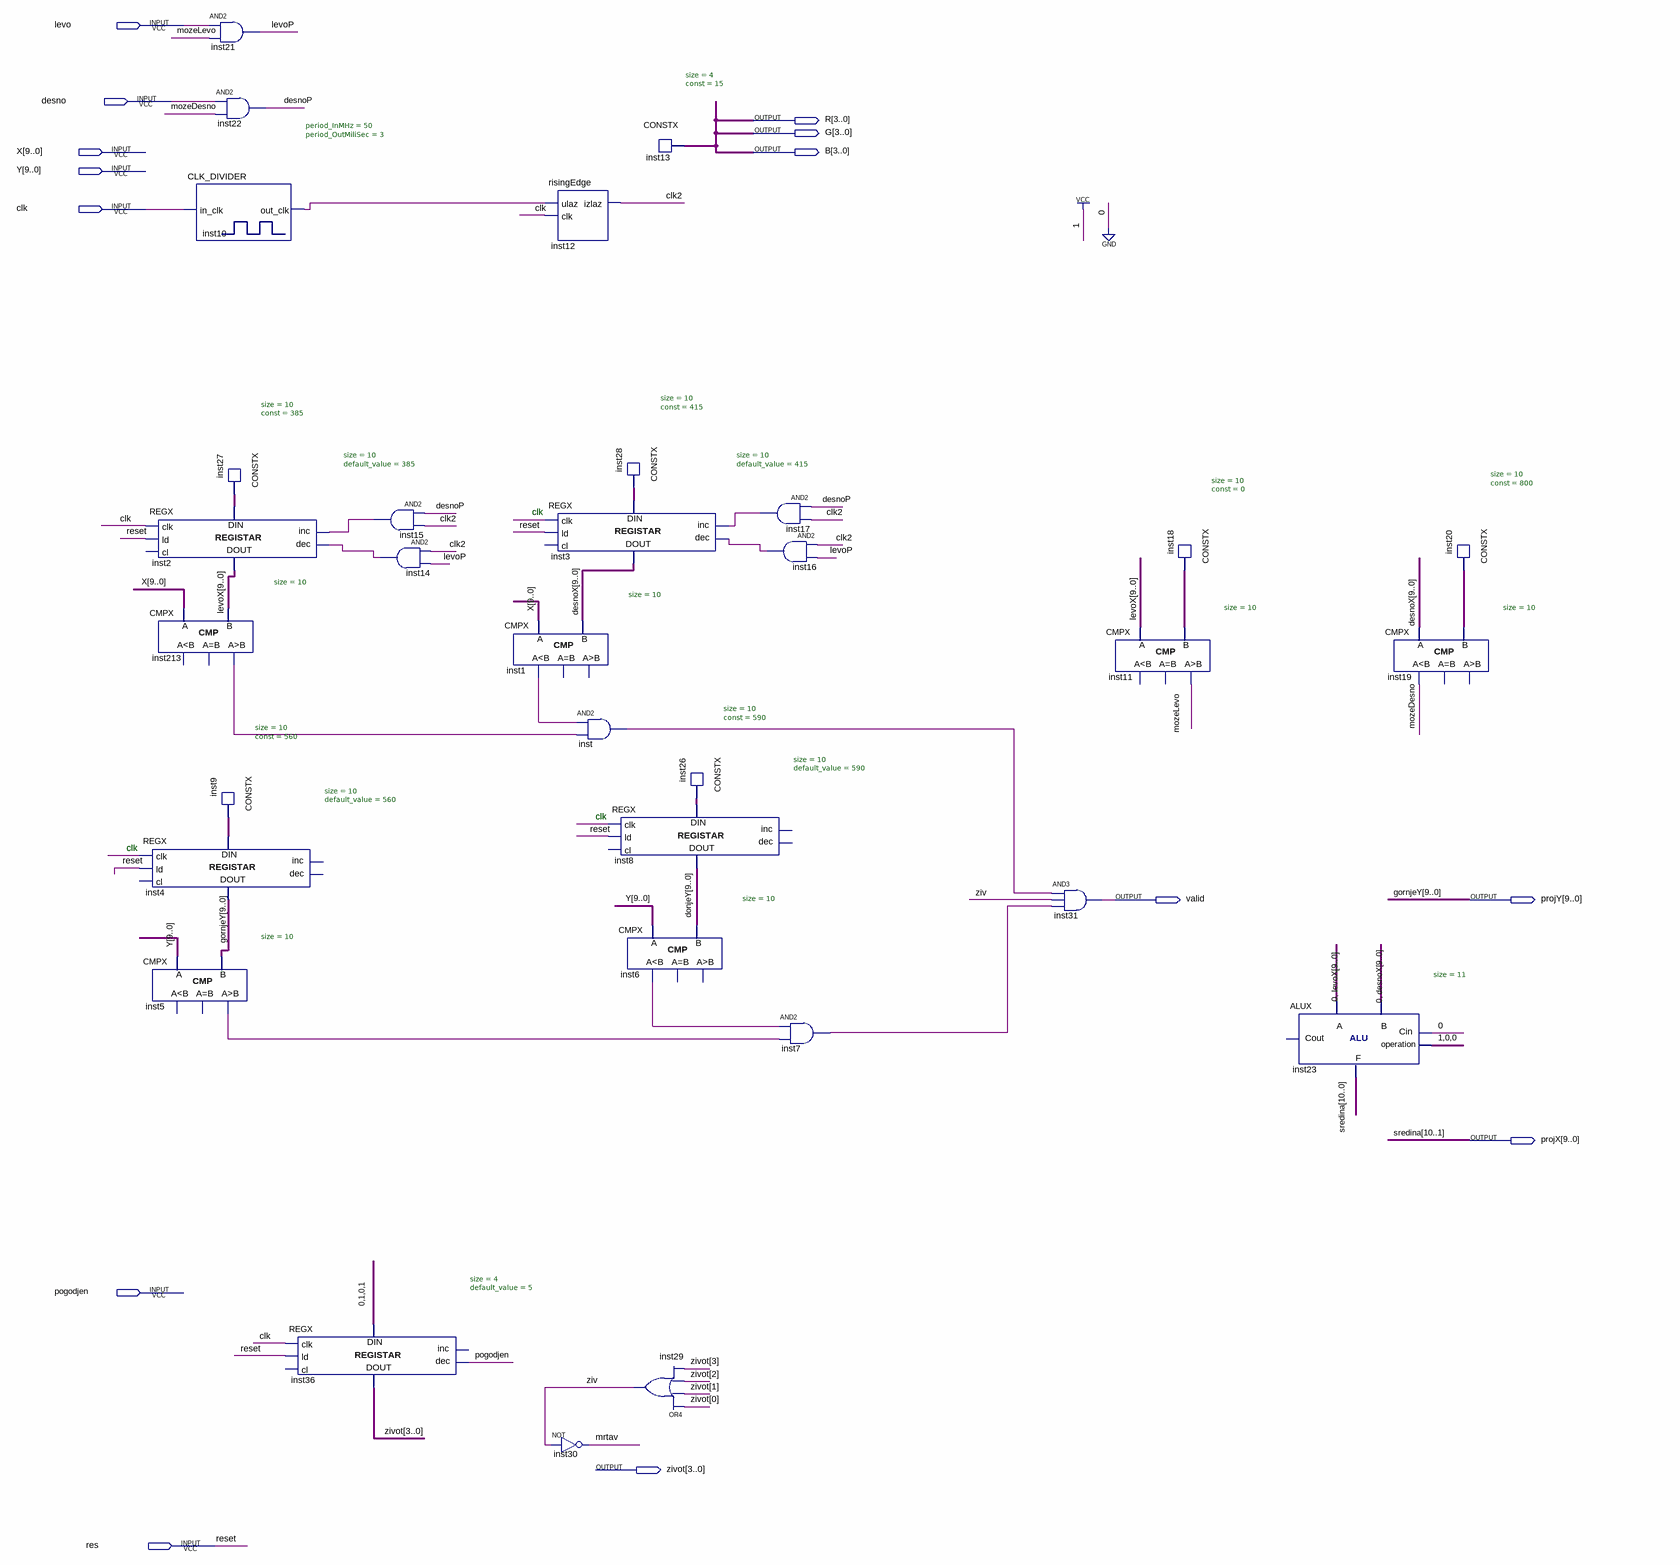
[diagram p0: schematic sheet]
// Quartus schematic player.bdf as structural Verilog: 32 symbols, 14 pins
module player (
  input  levo,
  input  desno,
  input  [9:0] X,
  input  [9:0] Y,
  input  clk,
  input  pogodjen,
  input  res,
  output [3:0] R,
  output [3:0] G,
  output [3:0] B,
  output valid,
  output [9:0] projY,
  output [9:0] projX,
  output [3:0] zivot
);

  wire clk2, desnoP, inst1_ls, inst5_gr, inst6_ls, inst7_out, inst10_out_clk, inst14_out, inst15_out,
       inst16_out, inst17_out, inst213_gr, inst_out, levoP, mozeDesno, mozeLevo, mrtav, ziv;
  wire [0:0] sredina;
  wire [9:0] desnoX, donjeY, inst9_data, inst18_data, inst20_data, inst26_data, inst27_data, inst28_data,
       levoX;

  REGX #(.size(10), .default_value(560)) inst4 (
    .clk(clk), .ld(res), .data_in(inst9_data), .data_out(projY));  // open: cl, inc, dec
  CMPX #(.size(10)) inst5 (.A(Y), .B(projY), .gr(inst5_gr));  // open: ls, eq
  CLK_DIVIDER #(.period_InMHz(50), .period_OutMiliSec(3)) inst10 (.in_clk(clk), .out_clk(inst10_out_clk));
  REGX #(.size(10), .default_value(385)) inst2 (
    .clk(clk), .ld(res), .inc(inst15_out), .dec(inst14_out), .data_in(inst27_data), .data_out(levoX));  // open: cl
  CMPX #(.size(10)) inst213 (.A(X), .B(levoX), .gr(inst213_gr));  // open: ls, eq
  and inst21 (levoP, levo, mozeLevo);
  and inst22 (desnoP, desno, mozeDesno);
  CONSTX #(.size(10), .\const (385)) inst27 (.data(inst27_data));
  CONSTX #(.size(10), .\const (560)) inst9 (.data(inst9_data));
  REGX #(.size(4), .default_value(5)) inst36 (
    .clk(clk), .ld(res), .dec(pogodjen), .data_in(4'b0101), .data_out(zivot));  // open: cl, inc
  and inst15 (inst15_out, desnoP, clk2);
  and inst14 (inst14_out, clk2, levoP);
  risingEdge inst12 (.ulaz(inst10_out_clk), .clk(clk), .izlaz(clk2));
  REGX #(.size(10), .default_value(415)) inst3 (
    .clk(clk), .ld(res), .inc(inst17_out), .dec(inst16_out), .data_in(inst28_data), .data_out(desnoX));  // open: cl
  CMPX #(.size(10)) inst1 (.A(X), .B(desnoX), .ls(inst1_ls));  // open: eq, gr
  and inst (inst_out, inst1_ls, inst213_gr);
  not inst30 (mrtav, ziv);
  CONSTX #(.size(4), .\const (15)) inst13 (.data(B));
  CONSTX #(.size(10), .\const (415)) inst28 (.data(inst28_data));
  REGX #(.size(10), .default_value(590)) inst8 (
    .clk(clk), .ld(res), .data_in(inst26_data), .data_out(donjeY));  // open: cl, inc, dec
  CMPX #(.size(10)) inst6 (.A(Y), .B(donjeY), .ls(inst6_ls));  // open: eq, gr
  or inst29 (ziv, zivot[0], zivot[1], zivot[2], zivot[3]);
  CONSTX #(.size(10), .\const (590)) inst26 (.data(inst26_data));
  and inst17 (inst17_out, desnoP, clk2);
  and inst16 (inst16_out, clk2, levoP);
  and inst7 (inst7_out, inst6_ls, inst5_gr);
  and inst31 (valid, inst_out, ziv, inst7_out);
  CMPX #(.size(10)) inst11 (.A(levoX), .B(inst18_data), .gr(mozeLevo));  // open: ls, eq
  CONSTX #(.size(10), .\const (0)) inst18 (.data(inst18_data));
  ALUX #(.size(11)) inst23 (
    .Cin(1'b0), .B({1'b0, desnoX}), .A({1'b0, levoX}), .op(3'b100), .F({projX, sredina[0]}));  // open: Cout
  CMPX #(.size(10)) inst19 (.A(desnoX), .B(inst20_data), .ls(mozeDesno));  // open: eq, gr
  CONSTX #(.size(10), .\const (800)) inst20 (.data(inst20_data));

  assign G = B;
  assign R = B;

  // Other names for the same wires on the sheet: gornjeY[9:0] = projY; reset = res; sredina[10:1] = projX

  // Notes on the sheet:
  //   clk
  //   clk
  //   clk
endmodule
